# EAGLE design universal_sensor_node (EAGLE 9.5.0)
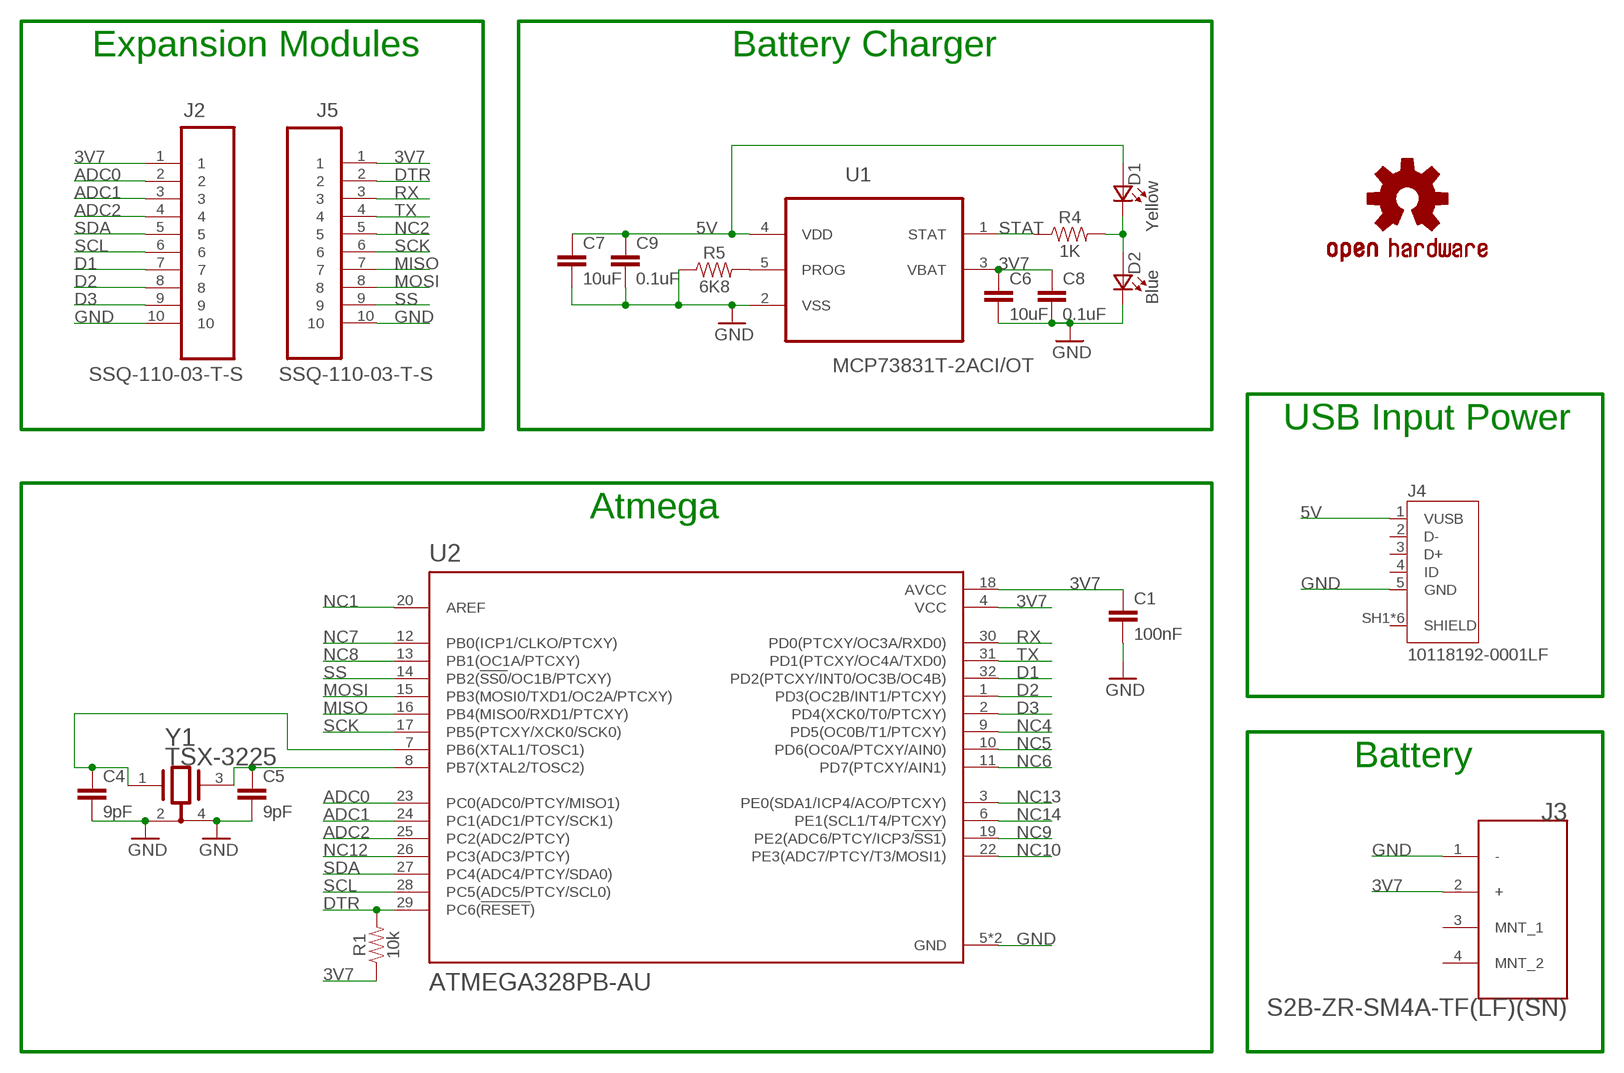
[diagram p0: schematic, sheet 1]

## Parts
C1  100nF  100NF-50V-10%(0603)  [0603-CAP]
C4  9pF  9PF-50V(0603)  [0603-CAP]
C5  9pF  9PF-50V(0603)  [0603-CAP]
C6  10uF  CAP_0603_10UF  [0603-CAP]
C7  10uF  CAP_0603_10UF  [0603-CAP]
C8  0.1uF  CAP_0603_0.1UF  [0603-CAP]
C9  0.1uF  CAP_0603_0.1UF  [0603-CAP]
D1  Yellow  LTST-C191KSKT  [0603]
D2  Blue  LTST-C193TBKT-5A  [0603]
J2  SSQ-110-03-T-S  [SAMTEC_SSQ-110-03-T-S]
J3  JST_S2B-ZR-SM4A-TF_LF_SNJST_S2B-ZR-SM4A-TF_LF_SN_0_0  [JST_S2B-ZR-SM4A-TF_LF_SN_0]
J4  10118192-0001LF  [AMPHENOL_10118192-0001LF]
J5  SSQ-110-03-T-S  [SAMTEC_SSQ-110-03-T-S]
LOGO1  OSHW-LOGOMINI  [OSHW-LOGO-MINI]
R1  10k  RES_0603_10K_1%_.1W-0603-1/10W-1%  [0603-RES]
R4  1K  RES_0603_1K_1%_.1W-0603-1/10W-1%  [0603-RES]
R5  6K8  RES_0603_6.8K_1%_.1W-0603-1/10W-1%  [0603-RES]
U1  MCP73831T-2ACI/OT  [SOT95P280X145-5N]
U2  ATMEGA328PB-AU  [QFP80P900X900X120-32N]
Y1  TSX-3225EPSON_TSX-3225_16.0000MF09Z-AC3_0_0  [TSX-3225]

## Nets
3V7: C1.1 C6.1 C8.1 J2.1 J3.2(+) J5.1 R1.1 U1.3(VBAT) U2.4(VCC) U2.18(AVCC)
5V: C7.1 C9.1 D1.2(A2) J4.1(VUSB) U1.4(VDD)
ADC0: J2.2 U2.23(PC0(ADC0/PTCY/MISO1))
ADC1: J2.3 U2.24(PC1(ADC1/PTCY/SCK1))
ADC2: J2.4 U2.25(PC2(ADC2/PTCY))
D1: J2.7 U2.32(PD2(PTCXY/INT0/OC3B/OC4B))
D2: J2.8 U2.1(PD3(OC2B/INT1/PTCXY))
D3: J2.9 U2.2(PD4(XCK0/T0/PTCXY))
DTR: J5.2 R1.2 U2.29(PC6(!RESET!))
GND: C1.2 C4.2 C5.2 C6.2 C7.2 C8.2 C9.2 D2.1(K2) J2.10 J3.1(-) J4.5(GND) J5.10 R5.1 U1.2(VSS) U2.5(GND) U2.21(GND) Y1.2(1_GND) Y1.4(2_GND)
MISO: J5.7 U2.16(PB4(MISO0/RXD1/PTCXY))
MOSI: J5.8 U2.15(PB3(MOSI0/TXD1/OC2A/PTCXY))
N$10: R5.2 U1.5(PROG)
N$11: D1.1(K2) D2.2(A2) R4.2
N$26: C4.1 U2.7(PB6(XTAL1/TOSC1)) Y1.1
N$27: C5.1 U2.8(PB7(XTAL2/TOSC2)) Y1.3
NC1: U2.20(AREF)
NC2: J5.5
NC4: U2.9(PD5(OC0B/T1/PTCXY))
NC5: U2.10(PD6(OC0A/PTCXY/AIN0))
NC6: U2.11(PD7(PTCXY/AIN1))
NC7: U2.12(PB0(ICP1/CLKO/PTCXY))
NC8: U2.13(PB1(OC1A/PTCXY))
NC9: U2.19(PE2(ADC6/PTCY/ICP3/!SS1!))
NC10: U2.22(PE3(ADC7/PTCY/T3/MOSI1))
NC12: U2.26(PC3(ADC3/PTCY))
NC13: U2.3(PE0(SDA1/ICP4/ACO/PTCXY))
NC14: U2.6(PE1(SCL1/T4/PTCXY))
RX: J5.3 U2.30(PD0(PTCXY/OC3A/RXD0))
SCK: J5.6 U2.17(PB5(PTCXY/XCK0/SCK0))
SCL: J2.6 U2.28(PC5(ADC5/PTCY/SCL0))
SDA: J2.5 U2.27(PC4(ADC4/PTCY/SDA0))
SS: J5.9 U2.14(PB2(!SS0!/OC1B/PTCXY))
STAT: R4.1 U1.1(STAT)
TX: J5.4 U2.31(PD1(PTCXY/OC4A/TXD0))
Unconnected: J3.3(MNT_1) J3.4(MNT_2) J4.2(D-) J4.3(D+) J4.4(ID) J4.SH1(SHIELD) J4.SH2(SHIELD) J4.SH3(SHIELD) J4.SH4(SHIELD) J4.SH5(SHIELD) J4.SH6(SHIELD)

## Notes on the sheet
- Expansion Modules | Battery Charger
- USB Input Power
- Atmega
- Battery

## Library data of the parts
C1 = universal_sensor_node:100NF-50V-10%(0603): CAP-07883; DIGI-KEY_PN: 1276-1000-1-ND; MPN: CL10B104KB8NNNC; VERIFIED: no
C4 C5 = universal_sensor_node:9PF-50V(0603): CAP CER CAP CER 9PF 50V NP0 0603; DIGI-KEY_PN: CBR06C909B5GAC; MPN: CBR06C909B5GAC; VERIFIED: no
C6 C7 = universal_sensor_node:CAP_0603_10UF: 10µF ±10% 10V Ceramic Capacitor X5R 0603 (1608 Metric); DIGI-KEY_PN: 490-14372-1-ND; MPN: GRM188R61A106KE69J; VERIFIED: no
C8 C9 = universal_sensor_node:CAP_0603_0.1UF: 0.1µF ±10% 50V Ceramic Capacitor X7R 0603 (1608 Metric); DIGI-KEY_PN: 1276-CL10B104KB8NNNLCT-ND; MPN: CL10B104KB8NNNL; VERIFIED: no
D1 = universal_sensor_node:LTST-C191KSKT: http://octopart.com/ltst-c190krkt-lite-on-549893; DIGI-KEY_PN: 160-1448-1-ND; MF: Lite-On Inc.; MPN: LTST-C191KSKT; PACKAGE: 0603 Lite-On; VERIFIED: no
D2 = universal_sensor_node:LTST-C193TBKT-5A: http://octopart.com/ltst-c190tbkt-lite-on-550003; DIGI-KEY_PN: 160-1827-1-ND; MF: Lite-On Inc.; MPN: LTST-C193TBKT-5A; PACKAGE: 0603 Lite-On; VERIFIED: no
J2 J5 = universal_sensor_node:SSQ-110-03-T-S: CONN SOCKET, 2.54MM, THT VERT, 10POS; DIGI-KEY_PN: SAM1206-10-ND; MF: Samtec; MPN: SSQ-110-03-T-S; PACKAGE: None; VERIFIED: no
J3 = universal_sensor_node:JST_S2B-ZR-SM4A-TF_LF_SN: 2 Positions Header Shrouded Connector 0.059" (1.50mm) Surface Mount Right Angle Tin; DIGI-KEY_PN: 455-1693-1-ND; MF: JST; MPN: S2B-ZR-SM4A-TF(LF)(SN); PACKAGE: HDR02; VERIFIED: no
J4 = universal_sensor_node:10118192-0001LF: Single Port 5 Contact Horizontal Right Angle Shielded Micro B USB 2.0 Connector; DIGI-KEY_PN: 609-4613-1-ND; MF: Amphenol ICC; MPN: 10118192-0001LF; PACKAGE: None; VERIFIED: no
LOGO1 = SparkFun-Aesthetics:OSHW-LOGO: Open Source Hardware Logo This logo indicates the piece of hardware it is found on incorporates a OSHW license and/or adheres to the definition of open source hardware found here: http://freedomdefined.org/OSHW
R1 = universal_sensor_node:RES_0603_10K_1%_.1W: 10 kOhms ±1% 0.1W, 1/10W Chip Resistor 0603 (1608 Metric) Moisture Resistant Thick Film; DIGI-KEY_PN: 311-10.0KHRCT-ND; MPN: RC0603FR-0710KL; VERIFIED: no
R4 = universal_sensor_node:RES_0603_1K_1%_.1W: 1 kOhms ±1% 0.1W, 1/10W Chip Resistor 0603 (1608 Metric) Moisture Resistant Thick Film; DIGI-KEY_PN: 311-1.00KHRCT-ND; MPN: RC0603FR-071KL; VERIFIED: no
R5 = universal_sensor_node:RES_0603_6.8K_1%_.1W: 6.8 kOhms ±1% 0.1W, 1/10W Chip Resistor 0603 (1608 Metric) Moisture Resistant Thick Film; DIGI-KEY_PN: 311-6.80KHRCT-ND; MPN: RC0603FR-076K8L; VERIFIED: no
U1 = universal_sensor_node:MCP73831T-2ACI/OT: Charge Management Controller; DIGI-KEY_PN: MCP73831T-2ACI/OTCT-ND; MF: Microchip; MPN: MCP73831T-2ACI/OT; PACKAGE: SOT-23 Microchip; VERIFIED: no
U2 = universal_sensor_node:ATMEGA328PB-AU: ATmega Series 20 MHz 32 KB Flash 2 KB SRAM 8-Bit Microcontroller - TQFP-32; DIGI-KEY_PN: ATMEGA328PB-AURCT-ND; MF: Microchip; MPN: ATMEGA328PB-AU; PACKAGE: TQFP-32 Microchip; VERIFIED: no
Y1 = universal_sensor_node:TSX-3225: EPSON_TSX-3225_16.0000MF09Z-AC3; DIGI-KEY_PN: SER3628CT-ND; MF: Epson; MPN: TSX-3225 16.0000MF09Z-AC3; PACKAGE: XTAL_SMD_3MM2_2MM5; VERIFIED: no

## Board
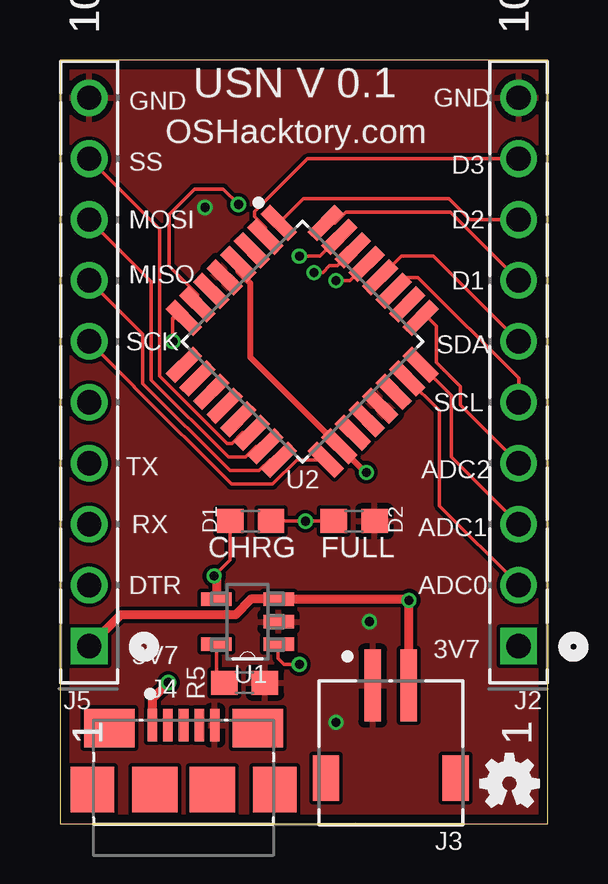
[diagram p1: board, top side]
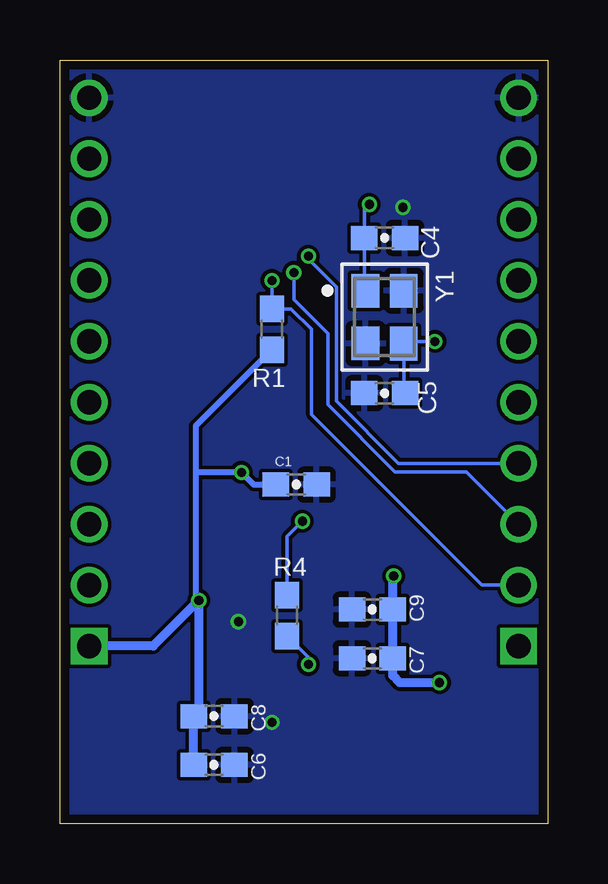
[diagram p2: board, bottom side, seen from below]

Size 20.35 x 31.85 mm. Coordinates in mm from the lower left corner, seen from the top.
Outline: 0,0 20.35,0 20.35,31.85 0,31.85 0,0
Copper layers (1*16): Top 0.035559375mm / dielectric 1.6mm / Bottom 0.035559375mm
Design rules "oshpark-2layer": minimum track width 6mil, minimum drill 10mil, track to track 6mil, track to pad 6mil, pad to pad 6mil, via to via 6mil, smd to smd 6mil, copper to edge 15mil, drill to drill 6mil, minimum pad ring 5mil, minimum via ring 5mil, stop-mask expansion 2.5mil, vias tented up to drill 0mil, thermal gap 10mil

### Footprints (pad centres in the part's own frame; a part is rotated, then mirrored left to right if it is on the bottom)
0603-CAP = smd 1.1 x 1: 1 -0.85,0; 2 0.85,0
0603 = smd 1.1 x 1: 1 -0.85,0; 2 0.85,0
SAMTEC_SSQ-110-03-T-S = drill 1.016 square: 1 -22.86,0 | drill 1.016: 2 -20.32,0; 3 -17.78,0; 4 -15.24,0; 5 -12.7,0; 6 -10.16,0; 7 -7.62,0; 8 -5.08,0; 9 -2.54,0; 10 0,0
JST_S2B-ZR-SM4A-TF_LF_SN_0 = smd 0.7 x 3: 1 0.75,-2.8; 2 -0.75,-2.8 | smd 1.1 x 1.9: 3 -2.7,1.05; 4 2.7,1.05
AMPHENOL_10118192-0001LF = smd 0.4 x 1.35: 1 -1.3,0; 2 -0.65,0; 3 0,0; 4 0.65,0; 5 1.3,0 | smd 2.1 x 1.6: SH1 -3.1,-0.125; SH2 3.1,-0.125 | smd 1.8 x 1.9: SH3 -3.8,-2.675; SH6 3.8,-2.675 | smd 1.9 x 1.9: SH4 -1.2,-2.675; SH5 1.2,-2.675
0603-RES = smd 1.1 x 1: 1 -0.85,0; 2 0.85,0
SOT95P280X145-5N = smd 1.27 x 0.559: 1 -1.295,0.94; 2 -1.295,0; 3 -1.295,-0.94; 4 1.295,-0.94; 5 1.295,0.94
QFP80P900X900X120-32N = smd 1.6 x 0.55: 1 -4.18,2.8; 2 -4.18,2; 3 -4.18,1.2; 4 -4.18,0.4; 5 -4.18,-0.4; 6 -4.18,-1.2; 7 -4.18,-2; 8 -4.18,-2.8; 17 4.18,-2.8; 18 4.18,-2; 19 4.18,-1.2; 20 4.18,-0.4; 21 4.18,0.4; 22 4.18,1.2; 23 4.18,2; 24 4.18,2.8 | smd 0.55 x 1.6: 9 -2.8,-4.18; 10 -2,-4.18; 11 -1.2,-4.18; 12 -0.4,-4.18; 13 0.4,-4.18; 14 1.2,-4.18; 15 2,-4.18; 16 2.8,-4.18; 25 2.8,4.18; 26 2,4.18; 27 1.2,4.18; 28 0.4,4.18; 29 -0.4,4.18; 30 -1.2,4.18; 31 -2,4.18; 32 -2.8,4.18
TSX-3225 = smd 1.4 x 1.15: 1 -1.1,-0.8; 2 1.1,-0.8; 3 1.103,0.8; 4 -1.097,0.8

### Placement (x,y rotation side)
C1  10.49,14.15 0 bottom
C4  6.81,24.43 0 bottom
C5  6.81,17.96 180 bottom
C6  13.92,2.46 0 bottom
C7  7.32,6.91 180 bottom
C8  13.92,4.5 0 bottom
C9  7.32,8.94 180 bottom
D1  7.95,12.62 180 top
D2  12.27,12.62 180 top
J2  19.13,30.28 90 top
J3  13.79,2.97 180 top
J4  5.16,4.11 0 top
J5  1.22,30.28 90 top
LOGO1  18.75,1.7 0 top
R1  11.51,20.62 90 bottom
R4  10.87,8.69 90 bottom
R5  7.7,5.89 180 top
U1  7.82,8.43 180 top
U2  10.11,20.12 315 top
Y1  6.81,21.13 270 bottom

### Tracks (layer width: path | path; a pad name or v marks a point on that pad's centre or on a via)
3V7  (via drill 0.38)
  Top 0.254: U2.4 7.44,23.04 7.94,22.54 7.94,19.46 U2.18 12.74,14.66 v12.78,14.66
  Top 0.381: 14.54,9.33 v14.55,9.32 | J3.2 14.54,9.33 | 14.54,9.33 14.5,9.37 U1.3 7.96,9.37 7.32,8.72 2.53,8.72 J5.1
  Bottom 0.254: R1.1 14.68,16.6 14.68,14.66 | 14.68,14.66 14.68,9.19 | 14.68,14.66 v12.78,14.66 12.27,14.15 C1.1
  Bottom 0.381: C6.1 C8.1 14.55,4.71 v14.55,9.32 14.68,9.19 16.46,7.42 J2.1
5V  (via drill 0.38)
  Top 0.152: v6.43,10.34 7.1,11.01 D1.2
  Top 0.381: J4.1 3.86,5.23 v4.52,5.89 | v6.43,10.34 6.53,10.24 U1.4
  Bottom 0.381: v4.52,5.89 6.17,5.89 6.47,6.19 C7.1 C9.1 6.47,10.3 v6.43,10.34
ADC0
  Top 0.152: J2.2 15.82,13.26 15.82,17.23 U2.23
ADC1
  Top 0.152: J2.3 16.33,15.29 16.33,17.85 U2.24
ADC2
  Top 0.152: J2.4 16.69,17.47 16.69,18.25 15.7,19.24 15.7,20.75 15.36,21.09 U2.25
D1
  Top 0.152: U2.32 11.47,25.05 11.92,25.5 16.28,25.5 J2.7
D2
  Top 0.152: J2.8 17.09,25.2 16.22,26.07 10.15,26.07 U2.1
D3
  Top 0.152: U2.2 8.57,24.87 8.12,25.32 8.12,25.53 10.33,27.74 J2.9
DTR  (via drill 0.38)
  Top 0.152: v11.51,22.66 12.08,22.66 U2.29
  Bottom 0.152: J5.2 2.74,9.96 9.86,17.07 9.86,20.62 10.71,21.47 R1.2 v11.51,22.66
GND  (via drill 0.38)
  other vias: 6.05,25.7 11.51,4.24 12.9,8.43
  pour Bottom: 0.03,31.8 20.32,31.8 20.32,-0.03 0.03,-0.03
  pour Top: 0.08,31.8 20.4,31.8 20.4,0.05 0.08,0.05
MISO
  Top 0.152: J5.7 3.45,20.43 3.45,18.37 7.09,14.73 8.3,14.73 8.75,15.18 U2.16
MOSI
  Top 0.152: J5.8 3.8,22.61 3.8,18.52 7.02,15.3 7.74,15.3 8.18,15.75 U2.15
N$10
  Top 0.152: R5.2 6.53,6.21 U1.5
N$11  (via drill 0.38)
  Top 0.152: D1.1 v10.24,12.62 D2.2
  Bottom 0.152: R4.2 10.87,11.99 v10.24,12.62
N$26  (via drill 0.38)
  Top 0.152: U2.7 5.74,22.08 4.55,23.26 4.55,25.41 5.61,26.47 6.81,26.47 v7.44,25.83
  Bottom 0.152: Y1.1 7.66,22.23 C4.1 7.66,25.83 v7.44,25.83
N$27  (via drill 0.38)
  Top 0.152: U2.8 4.71,21.09 v4.71,20.12
  Bottom 0.152: v4.71,20.12 6.01,20.12 Y1.3 6.01,17.96 C5.1
RX  (via drill 0.38)
  Top 0.152: v10.59,22.99 10.96,22.99 11.25,23.28 11.57,23.28 U2.30
  Bottom 0.152: v10.59,22.99 10.59,21.87 9.17,20.45 9.17,17.48 6.37,14.68 3.4,14.68 J5.3
SCK
  Top 0.152: J5.6 3.09,18.24 3.09,18.22 7.15,14.17 8.87,14.17 9.88,15.18 U2.17
SCL
  Top 0.152: J2.6 15.57,23.67 14.23,23.67 U2.28
SDA
  Top 0.152: J2.5 19.13,18.59 14.94,22.78 14.47,22.78 U2.27
SS
  Top 0.152: U2.14 7.62,16.31 7.17,15.86 6.96,15.86 4.16,18.66 4.16,24.8 J5.9
STAT  (via drill 0.38)
  Top 0.152: v9.98,6.65 9.35,6.65 9.09,6.91 9.09,7.47 U1.1
  Bottom 0.152: R4.1 9.98,6.95 v9.98,6.65
TX  (via drill 0.38)
  Top 0.152: v9.98,23.67 10.84,23.67 U2.31
  Bottom 0.152: v9.98,23.67 9.98,23.55 8.82,22.38 8.82,17.63 6.22,15.04 J5.4

### Text on the board
tPlace: USN V 0.1 | OSHacktory.com | SS | MOSI | D2 | MISO | D1 | SCK | SDA | SCL | TX | ADC2 | RX | ADC1 | ADC0 | 3V7 | 3V7
tNames: GND | GND | D3 | CHRG | FULL | DTR